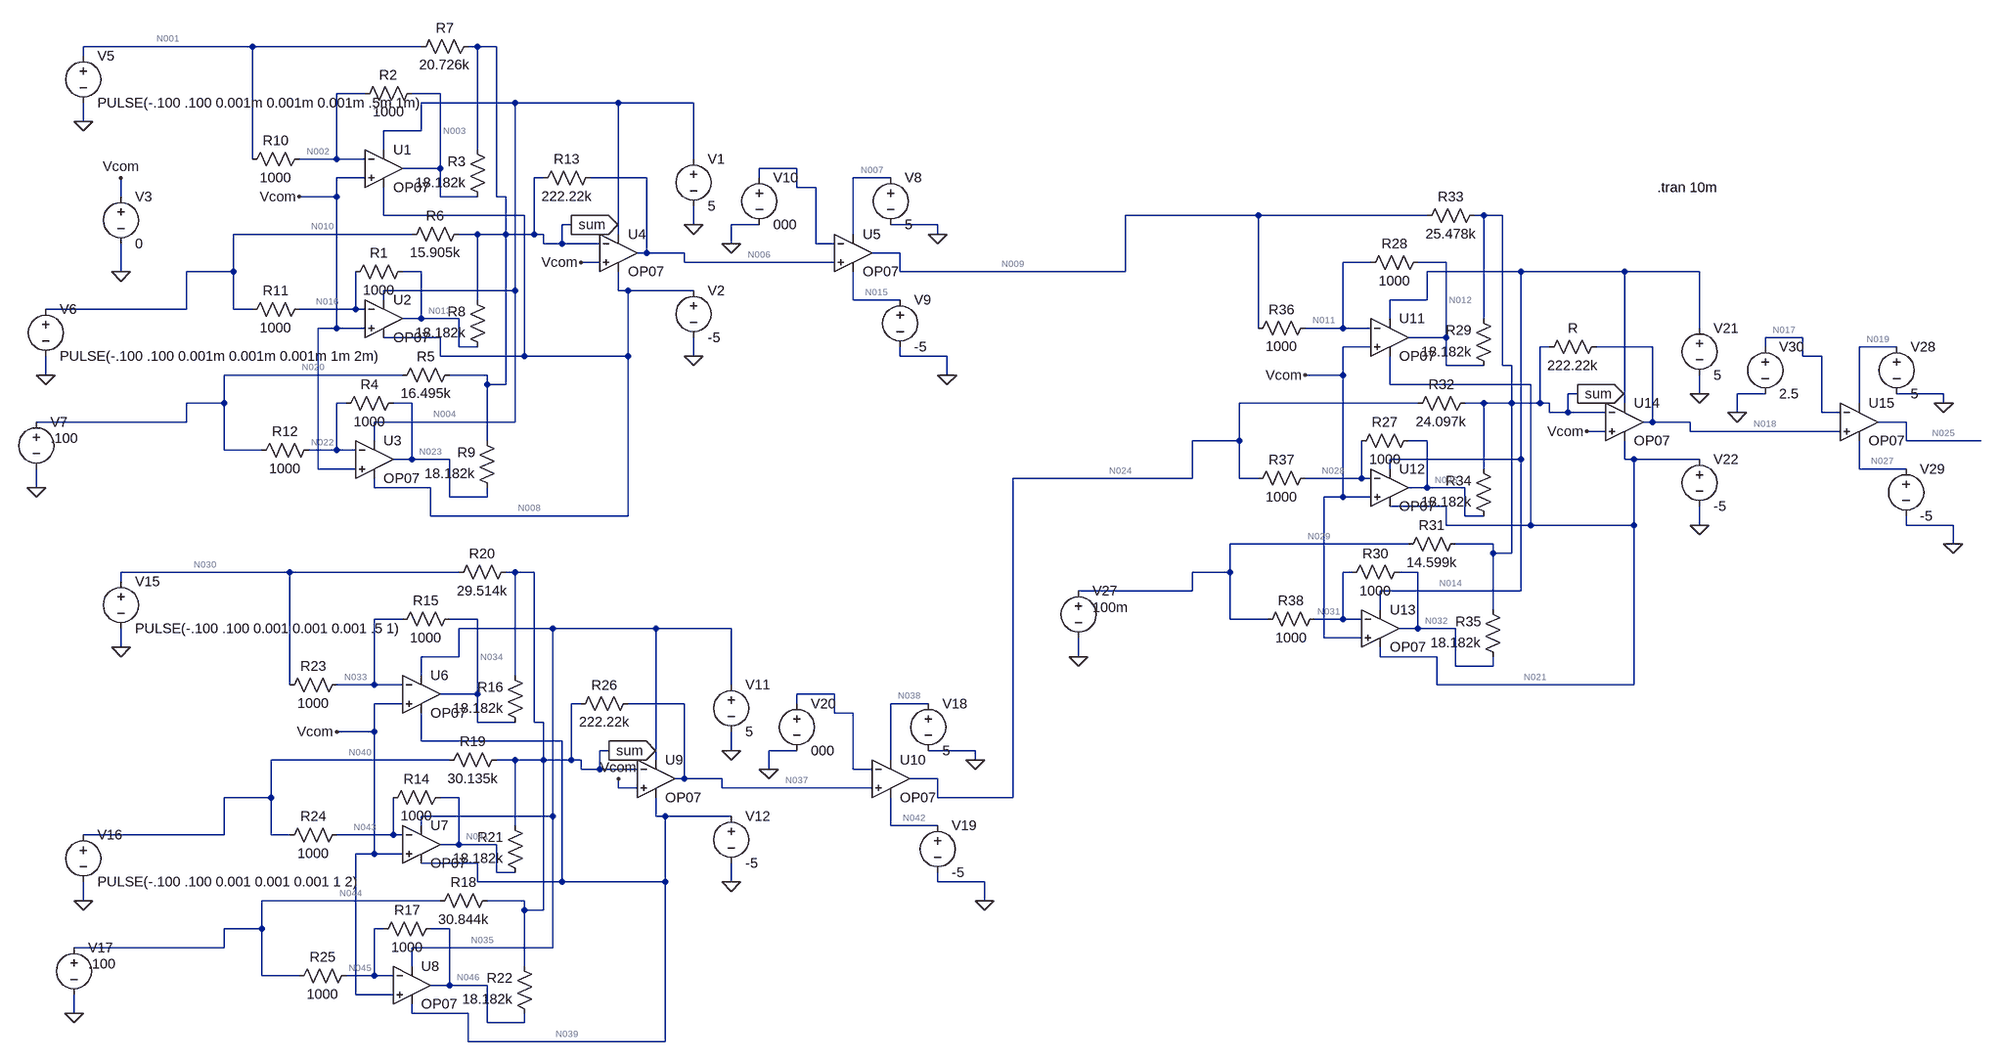
[diagram p0: schematic madaline.asc]
madaline.asc, the LTspice schematic file:
Version 4
SHEET 1 880 680
WIRE -2400 -2560 -2688 -2560
WIRE -2112 -2560 -2400 -2560
WIRE -2016 -2560 -2032 -2560
WIRE -1984 -2560 -2016 -2560
WIRE -2688 -2544 -2688 -2560
WIRE -2208 -2480 -2256 -2480
WIRE -2080 -2480 -2128 -2480
WIRE -1952 -2464 -2112 -2464
WIRE -1776 -2464 -1952 -2464
WIRE -1648 -2464 -1776 -2464
WIRE -2688 -2432 -2688 -2464
WIRE -2112 -2416 -2112 -2464
WIRE -2112 -2416 -2176 -2416
WIRE -2176 -2384 -2176 -2416
WIRE -2016 -2384 -2016 -2560
WIRE -2400 -2368 -2400 -2560
WIRE -2256 -2368 -2256 -2480
WIRE -2256 -2368 -2320 -2368
WIRE -2208 -2368 -2256 -2368
WIRE -1648 -2368 -1648 -2464
WIRE -2080 -2352 -2080 -2480
WIRE -2080 -2352 -2144 -2352
WIRE -1472 -2352 -1536 -2352
WIRE -2208 -2336 -2256 -2336
WIRE -1904 -2336 -1920 -2336
WIRE -1728 -2336 -1824 -2336
WIRE -1536 -2336 -1536 -2352
WIRE -1312 -2336 -1376 -2336
WIRE -1472 -2320 -1472 -2352
WIRE -1440 -2320 -1472 -2320
WIRE -2624 -2304 -2624 -2336
WIRE -2256 -2304 -2256 -2336
WIRE -2256 -2304 -2320 -2304
WIRE -2080 -2304 -2080 -2352
WIRE -2016 -2304 -2080 -2304
WIRE -1984 -2304 -1984 -2560
WIRE -1968 -2304 -1984 -2304
WIRE -2176 -2272 -2176 -2320
WIRE -1936 -2272 -2176 -2272
WIRE -624 -2272 -912 -2272
WIRE -336 -2272 -624 -2272
WIRE -240 -2272 -256 -2272
WIRE -208 -2272 -240 -2272
WIRE -1856 -2256 -1872 -2256
WIRE -1648 -2256 -1648 -2288
WIRE -1536 -2256 -1584 -2256
WIRE -1232 -2256 -1312 -2256
WIRE -2128 -2240 -2432 -2240
WIRE -2016 -2240 -2048 -2240
WIRE -1968 -2240 -1968 -2304
WIRE -1968 -2240 -2016 -2240
WIRE -1920 -2240 -1920 -2336
WIRE -1920 -2240 -1968 -2240
WIRE -1904 -2240 -1920 -2240
WIRE -1776 -2240 -1776 -2464
WIRE -1376 -2240 -1376 -2336
WIRE -1232 -2240 -1232 -2256
WIRE -1904 -2224 -1904 -2240
WIRE -1872 -2224 -1872 -2256
WIRE -1872 -2224 -1904 -2224
WIRE -1808 -2224 -1872 -2224
WIRE -1584 -2224 -1584 -2256
WIRE -1440 -2224 -1440 -2320
WIRE -1408 -2224 -1440 -2224
WIRE -1728 -2208 -1728 -2336
WIRE -1728 -2208 -1744 -2208
WIRE -1664 -2208 -1728 -2208
WIRE -1296 -2208 -1344 -2208
WIRE -1808 -2192 -1840 -2192
WIRE -1664 -2192 -1664 -2208
WIRE -1408 -2192 -1664 -2192
WIRE -432 -2192 -480 -2192
WIRE -304 -2192 -352 -2192
WIRE -2624 -2176 -2624 -2224
WIRE -2432 -2176 -2432 -2240
WIRE -2432 -2176 -2512 -2176
WIRE -2112 -2176 -2144 -2176
WIRE -1296 -2176 -1296 -2208
WIRE -912 -2176 -912 -2272
WIRE -912 -2176 -1296 -2176
WIRE -176 -2176 -336 -2176
WIRE 0 -2176 -176 -2176
WIRE 128 -2176 0 -2176
WIRE -1952 -2144 -1952 -2464
WIRE -1952 -2144 -2176 -2144
WIRE -1776 -2144 -1776 -2176
WIRE -1760 -2144 -1776 -2144
WIRE -1648 -2144 -1760 -2144
WIRE -2176 -2128 -2176 -2144
WIRE -2016 -2128 -2016 -2240
WIRE -1376 -2128 -1376 -2176
WIRE -1296 -2128 -1376 -2128
WIRE -336 -2128 -336 -2176
WIRE -336 -2128 -400 -2128
WIRE -2512 -2112 -2512 -2176
WIRE -2512 -2112 -2752 -2112
WIRE -2432 -2112 -2432 -2176
WIRE -2400 -2112 -2432 -2112
WIRE -2224 -2112 -2224 -2176
WIRE -2224 -2112 -2320 -2112
WIRE -2208 -2112 -2224 -2112
WIRE -2112 -2096 -2112 -2176
WIRE -2112 -2096 -2144 -2096
WIRE -2048 -2096 -2112 -2096
WIRE -400 -2096 -400 -2128
WIRE -240 -2096 -240 -2272
WIRE -2256 -2080 -2256 -2304
WIRE -2256 -2080 -2288 -2080
WIRE -2208 -2080 -2256 -2080
WIRE -624 -2080 -624 -2272
WIRE -480 -2080 -480 -2192
WIRE -480 -2080 -544 -2080
WIRE -432 -2080 -480 -2080
WIRE 128 -2080 128 -2176
WIRE -2080 -2064 -2176 -2064
WIRE -304 -2064 -304 -2192
WIRE -304 -2064 -368 -2064
WIRE 304 -2064 240 -2064
WIRE -2048 -2048 -2048 -2096
WIRE -2016 -2048 -2048 -2048
WIRE -432 -2048 -480 -2048
WIRE -128 -2048 -144 -2048
WIRE 48 -2048 -48 -2048
WIRE 240 -2048 240 -2064
WIRE 464 -2048 400 -2048
WIRE -2080 -2032 -2080 -2064
WIRE -1936 -2032 -1936 -2272
WIRE -1936 -2032 -2080 -2032
WIRE -1760 -2032 -1760 -2144
WIRE -1760 -2032 -1936 -2032
WIRE -1648 -2032 -1648 -2064
WIRE -1296 -2032 -1296 -2048
WIRE -1216 -2032 -1296 -2032
WIRE 304 -2032 304 -2064
WIRE 336 -2032 304 -2032
WIRE -304 -2016 -304 -2064
WIRE -240 -2016 -304 -2016
WIRE -208 -2016 -208 -2272
WIRE -192 -2016 -208 -2016
WIRE -2752 -2000 -2752 -2032
WIRE -2144 -2000 -2448 -2000
WIRE -2000 -2000 -2064 -2000
WIRE -1216 -2000 -1216 -2032
WIRE -480 -2000 -480 -2048
WIRE -480 -2000 -544 -2000
WIRE -2000 -1984 -2000 -2000
WIRE -1968 -1984 -1968 -2240
WIRE -1968 -1984 -2000 -1984
WIRE -400 -1984 -400 -2032
WIRE -160 -1984 -400 -1984
WIRE -80 -1968 -96 -1968
WIRE 128 -1968 128 -2000
WIRE 240 -1968 192 -1968
WIRE 544 -1968 464 -1968
WIRE -2448 -1952 -2448 -2000
WIRE -2448 -1952 -2512 -1952
WIRE -2240 -1952 -2256 -1952
WIRE -2128 -1952 -2160 -1952
WIRE -352 -1952 -656 -1952
WIRE -240 -1952 -272 -1952
WIRE -192 -1952 -192 -2016
WIRE -192 -1952 -240 -1952
WIRE -144 -1952 -144 -2048
WIRE -144 -1952 -192 -1952
WIRE -128 -1952 -144 -1952
WIRE 0 -1952 0 -2176
WIRE 400 -1952 400 -2048
WIRE 544 -1952 544 -1968
WIRE -128 -1936 -128 -1952
WIRE -96 -1936 -96 -1968
WIRE -96 -1936 -128 -1936
WIRE -32 -1936 -96 -1936
WIRE 192 -1936 192 -1968
WIRE 336 -1936 336 -2032
WIRE 368 -1936 336 -1936
WIRE -2512 -1920 -2512 -1952
WIRE -2512 -1920 -2768 -1920
WIRE -1952 -1920 -1952 -2144
WIRE -1952 -1920 -2192 -1920
WIRE 48 -1920 48 -2048
WIRE 48 -1920 32 -1920
WIRE 112 -1920 48 -1920
WIRE 480 -1920 432 -1920
WIRE -32 -1904 -64 -1904
WIRE 112 -1904 112 -1920
WIRE 368 -1904 112 -1904
WIRE -2192 -1888 -2192 -1920
WIRE -2000 -1888 -2000 -1984
WIRE -656 -1888 -656 -1952
WIRE -656 -1888 -736 -1888
WIRE -336 -1888 -368 -1888
WIRE 480 -1888 480 -1920
WIRE 608 -1888 480 -1888
WIRE -2448 -1872 -2448 -1952
WIRE -2384 -1872 -2448 -1872
WIRE -2256 -1872 -2256 -1952
WIRE -2256 -1872 -2304 -1872
WIRE -2224 -1872 -2256 -1872
WIRE -2128 -1856 -2128 -1952
WIRE -2128 -1856 -2160 -1856
WIRE -2064 -1856 -2128 -1856
WIRE -176 -1856 -176 -2176
WIRE -176 -1856 -400 -1856
WIRE 0 -1856 0 -1888
WIRE 16 -1856 0 -1856
WIRE 128 -1856 16 -1856
WIRE -2288 -1840 -2288 -2080
WIRE -2224 -1840 -2288 -1840
WIRE -400 -1840 -400 -1856
WIRE -240 -1840 -240 -1952
WIRE 400 -1840 400 -1888
WIRE 480 -1840 400 -1840
WIRE -736 -1824 -736 -1888
WIRE -736 -1824 -1104 -1824
WIRE -656 -1824 -656 -1888
WIRE -624 -1824 -656 -1824
WIRE -448 -1824 -448 -1888
WIRE -448 -1824 -544 -1824
WIRE -432 -1824 -448 -1824
WIRE -2768 -1808 -2768 -1840
WIRE -2192 -1808 -2192 -1824
WIRE -2096 -1808 -2192 -1808
WIRE -336 -1808 -336 -1888
WIRE -336 -1808 -368 -1808
WIRE -272 -1808 -336 -1808
WIRE -2064 -1792 -2064 -1856
WIRE -2000 -1792 -2000 -1808
WIRE -2000 -1792 -2064 -1792
WIRE -480 -1792 -480 -2000
WIRE -480 -1792 -512 -1792
WIRE -432 -1792 -480 -1792
WIRE -304 -1776 -400 -1776
WIRE -2096 -1760 -2096 -1808
WIRE -1760 -1760 -1760 -2032
WIRE -1760 -1760 -2096 -1760
WIRE -272 -1760 -272 -1808
WIRE -240 -1760 -272 -1760
WIRE -304 -1744 -304 -1776
WIRE -160 -1744 -160 -1984
WIRE -160 -1744 -304 -1744
WIRE 16 -1744 16 -1856
WIRE 16 -1744 -160 -1744
WIRE 128 -1744 128 -1776
WIRE 480 -1744 480 -1760
WIRE 560 -1744 480 -1744
WIRE -368 -1712 -672 -1712
WIRE -224 -1712 -288 -1712
WIRE 560 -1712 560 -1744
WIRE -224 -1696 -224 -1712
WIRE -192 -1696 -192 -1952
WIRE -192 -1696 -224 -1696
WIRE -2336 -1664 -2624 -1664
WIRE -2048 -1664 -2336 -1664
WIRE -1952 -1664 -1968 -1664
WIRE -1920 -1664 -1952 -1664
WIRE -672 -1664 -672 -1712
WIRE -672 -1664 -736 -1664
WIRE -464 -1664 -480 -1664
WIRE -352 -1664 -384 -1664
WIRE -2624 -1648 -2624 -1664
WIRE -736 -1632 -736 -1664
WIRE -736 -1632 -992 -1632
WIRE -176 -1632 -176 -1856
WIRE -176 -1632 -416 -1632
WIRE -416 -1600 -416 -1632
WIRE -224 -1600 -224 -1696
WIRE -2144 -1584 -2192 -1584
WIRE -2016 -1584 -2064 -1584
WIRE -672 -1584 -672 -1664
WIRE -608 -1584 -672 -1584
WIRE -480 -1584 -480 -1664
WIRE -480 -1584 -528 -1584
WIRE -448 -1584 -480 -1584
WIRE -1888 -1568 -2048 -1568
WIRE -1712 -1568 -1888 -1568
WIRE -1584 -1568 -1712 -1568
WIRE -352 -1568 -352 -1664
WIRE -352 -1568 -384 -1568
WIRE -288 -1568 -352 -1568
WIRE -512 -1552 -512 -1792
WIRE -448 -1552 -512 -1552
WIRE -2624 -1536 -2624 -1568
WIRE -2048 -1520 -2048 -1568
WIRE -2048 -1520 -2112 -1520
WIRE -992 -1520 -992 -1552
WIRE -416 -1520 -416 -1536
WIRE -320 -1520 -416 -1520
WIRE -288 -1504 -288 -1568
WIRE -224 -1504 -224 -1520
WIRE -224 -1504 -288 -1504
WIRE -2112 -1488 -2112 -1520
WIRE -1952 -1488 -1952 -1664
WIRE -2336 -1472 -2336 -1664
WIRE -2192 -1472 -2192 -1584
WIRE -2192 -1472 -2256 -1472
WIRE -2144 -1472 -2192 -1472
WIRE -1584 -1472 -1584 -1568
WIRE -320 -1472 -320 -1520
WIRE 16 -1472 16 -1744
WIRE 16 -1472 -320 -1472
WIRE -2016 -1456 -2016 -1584
WIRE -2016 -1456 -2080 -1456
WIRE -1408 -1456 -1472 -1456
WIRE -2144 -1440 -2192 -1440
WIRE -1840 -1440 -1856 -1440
WIRE -1664 -1440 -1760 -1440
WIRE -1472 -1440 -1472 -1456
WIRE -1248 -1440 -1312 -1440
WIRE -1408 -1424 -1408 -1456
WIRE -1376 -1424 -1408 -1424
WIRE -2016 -1408 -2016 -1456
WIRE -1952 -1408 -2016 -1408
WIRE -1920 -1408 -1920 -1664
WIRE -1904 -1408 -1920 -1408
WIRE -2192 -1392 -2192 -1440
WIRE -2192 -1392 -2256 -1392
WIRE -2112 -1376 -2112 -1424
WIRE -1872 -1376 -2112 -1376
WIRE -1792 -1360 -1808 -1360
WIRE -1584 -1360 -1584 -1392
WIRE -1472 -1360 -1520 -1360
WIRE -1168 -1360 -1248 -1360
WIRE -2064 -1344 -2368 -1344
WIRE -1952 -1344 -1984 -1344
WIRE -1904 -1344 -1904 -1408
WIRE -1904 -1344 -1952 -1344
WIRE -1856 -1344 -1856 -1440
WIRE -1856 -1344 -1904 -1344
WIRE -1840 -1344 -1856 -1344
WIRE -1712 -1344 -1712 -1568
WIRE -1312 -1344 -1312 -1440
WIRE -1168 -1344 -1168 -1360
WIRE -1840 -1328 -1840 -1344
WIRE -1808 -1328 -1808 -1360
WIRE -1808 -1328 -1840 -1328
WIRE -1744 -1328 -1808 -1328
WIRE -1520 -1328 -1520 -1360
WIRE -1376 -1328 -1376 -1424
WIRE -1344 -1328 -1376 -1328
WIRE -1664 -1312 -1664 -1440
WIRE -1664 -1312 -1680 -1312
WIRE -1600 -1312 -1664 -1312
WIRE -1232 -1312 -1280 -1312
WIRE -1776 -1296 -1776 -1312
WIRE -1744 -1296 -1776 -1296
WIRE -1600 -1296 -1600 -1312
WIRE -1344 -1296 -1600 -1296
WIRE -2368 -1280 -2368 -1344
WIRE -2368 -1280 -2448 -1280
WIRE -2048 -1280 -2080 -1280
WIRE -1232 -1280 -1232 -1312
WIRE -1104 -1280 -1104 -1824
WIRE -1104 -1280 -1232 -1280
WIRE -1888 -1248 -1888 -1568
WIRE -1888 -1248 -2112 -1248
WIRE -1712 -1248 -1712 -1280
WIRE -1696 -1248 -1712 -1248
WIRE -1584 -1248 -1696 -1248
WIRE -2112 -1232 -2112 -1248
WIRE -1952 -1232 -1952 -1344
WIRE -1312 -1232 -1312 -1280
WIRE -1232 -1232 -1312 -1232
WIRE -2448 -1216 -2448 -1280
WIRE -2448 -1216 -2688 -1216
WIRE -2368 -1216 -2368 -1280
WIRE -2336 -1216 -2368 -1216
WIRE -2160 -1216 -2160 -1280
WIRE -2160 -1216 -2256 -1216
WIRE -2144 -1216 -2160 -1216
WIRE -2048 -1200 -2048 -1280
WIRE -2048 -1200 -2080 -1200
WIRE -1984 -1200 -2048 -1200
WIRE -2192 -1184 -2192 -1392
WIRE -2192 -1184 -2224 -1184
WIRE -2144 -1184 -2192 -1184
WIRE -2016 -1168 -2112 -1168
WIRE -1984 -1152 -1984 -1200
WIRE -1952 -1152 -1984 -1152
WIRE -2016 -1136 -2016 -1168
WIRE -1872 -1136 -1872 -1376
WIRE -1872 -1136 -2016 -1136
WIRE -1696 -1136 -1696 -1248
WIRE -1696 -1136 -1872 -1136
WIRE -1584 -1136 -1584 -1168
WIRE -1232 -1136 -1232 -1152
WIRE -1152 -1136 -1232 -1136
WIRE -2688 -1104 -2688 -1136
WIRE -2080 -1104 -2384 -1104
WIRE -1936 -1104 -2000 -1104
WIRE -1152 -1104 -1152 -1136
WIRE -1936 -1088 -1936 -1104
WIRE -1904 -1088 -1904 -1344
WIRE -1904 -1088 -1936 -1088
WIRE -2384 -1056 -2384 -1104
WIRE -2384 -1056 -2448 -1056
WIRE -2176 -1056 -2192 -1056
WIRE -2064 -1056 -2096 -1056
WIRE -2448 -1024 -2448 -1056
WIRE -2448 -1024 -2704 -1024
WIRE -1888 -1024 -1888 -1248
WIRE -1888 -1024 -2128 -1024
WIRE -2128 -992 -2128 -1024
WIRE -1936 -992 -1936 -1088
WIRE -2384 -976 -2384 -1056
WIRE -2320 -976 -2384 -976
WIRE -2192 -976 -2192 -1056
WIRE -2192 -976 -2240 -976
WIRE -2160 -976 -2192 -976
WIRE -2064 -960 -2064 -1056
WIRE -2064 -960 -2096 -960
WIRE -2000 -960 -2064 -960
WIRE -2224 -944 -2224 -1184
WIRE -2160 -944 -2224 -944
WIRE -2704 -912 -2704 -944
WIRE -2128 -912 -2128 -928
WIRE -2032 -912 -2128 -912
WIRE -2000 -896 -2000 -960
WIRE -1936 -896 -1936 -912
WIRE -1936 -896 -2000 -896
WIRE -2032 -864 -2032 -912
WIRE -1696 -864 -1696 -1136
WIRE -1696 -864 -2032 -864
FLAG -1648 -2256 0
FLAG -1648 -2032 0
FLAG -2624 -2176 0
FLAG -2688 -2432 0
FLAG -2752 -2000 0
FLAG -2768 -1808 0
FLAG -1232 -2240 0
FLAG -1216 -2000 0
FLAG -1584 -2224 0
FLAG -1856 -2256 sum
IOPIN -1856 -2256 Out
FLAG -1584 -1360 0
FLAG -1584 -1136 0
FLAG -2624 -1536 0
FLAG -2688 -1104 0
FLAG -2704 -912 0
FLAG -1168 -1344 0
FLAG -1152 -1104 0
FLAG -1520 -1328 0
FLAG -1792 -1360 sum
IOPIN -1792 -1360 Out
FLAG 128 -1968 0
FLAG 128 -1744 0
FLAG -992 -1520 0
FLAG 544 -1952 0
FLAG 560 -1712 0
FLAG 192 -1936 0
FLAG -80 -1968 sum
IOPIN -80 -1968 Out
FLAG -2624 -2336 Vcom
FLAG -2320 -2304 Vcom
FLAG -2256 -1392 Vcom
FLAG -544 -2000 Vcom
FLAG -1840 -2192 Vcom
FLAG -1776 -1312 Vcom
FLAG -64 -1904 Vcom
SYMBOL Opamps\\OP07 -2176 -2416 R0
SYMATTR InstName U1
SYMBOL Opamps\\OP07 -2176 -2160 R0
SYMATTR InstName U2
SYMBOL Opamps\\OP07 -2192 -1920 R0
SYMATTR InstName U3
SYMBOL Opamps\\OP07 -1776 -2272 R0
SYMATTR InstName U4
SYMBOL voltage -1648 -2384 R0
WINDOW 123 0 0 Left 2
WINDOW 39 0 0 Left 2
SYMATTR InstName V1
SYMATTR Value 5
SYMBOL voltage -1648 -2160 R0
WINDOW 123 0 0 Left 2
WINDOW 39 0 0 Left 2
SYMATTR InstName V2
SYMATTR Value -5
SYMBOL res -2128 -2192 R90
WINDOW 0 0 56 VBottom 2
WINDOW 3 32 56 VTop 2
SYMATTR InstName R1
SYMATTR Value 1000
SYMBOL res -2112 -2496 R90
WINDOW 0 0 56 VBottom 2
WINDOW 3 32 56 VTop 2
SYMATTR InstName R2
SYMATTR Value 1000
SYMBOL res -2000 -2288 R180
WINDOW 0 36 76 Left 2
WINDOW 3 36 40 Left 2
SYMATTR InstName R3
SYMATTR Value 18.182k
SYMBOL res -2144 -1968 R90
WINDOW 0 0 56 VBottom 2
WINDOW 3 32 56 VTop 2
SYMATTR InstName R4
SYMATTR Value 1000
SYMBOL res -2048 -2016 R90
WINDOW 0 0 56 VBottom 2
WINDOW 3 32 56 VTop 2
SYMATTR InstName R5
SYMATTR Value 16.495k
SYMBOL res -2032 -2256 R90
WINDOW 0 0 56 VBottom 2
WINDOW 3 32 56 VTop 2
SYMATTR InstName R6
SYMATTR Value 15.905k
SYMBOL res -2016 -2576 R90
WINDOW 0 0 56 VBottom 2
WINDOW 3 32 56 VTop 2
SYMATTR InstName R7
SYMATTR Value 20.726k
SYMBOL res -2000 -2032 R180
WINDOW 0 36 76 Left 2
WINDOW 3 36 40 Left 2
SYMATTR InstName R8
SYMATTR Value 18.182k
SYMBOL res -1984 -1792 R180
WINDOW 0 36 76 Left 2
WINDOW 3 36 40 Left 2
SYMATTR InstName R9
SYMATTR Value 18.182k
SYMBOL res -2304 -2384 R90
WINDOW 0 0 56 VBottom 2
WINDOW 3 32 56 VTop 2
SYMATTR InstName R10
SYMATTR Value 1000
SYMBOL res -2304 -2128 R90
WINDOW 0 0 56 VBottom 2
WINDOW 3 32 56 VTop 2
SYMATTR InstName R11
SYMATTR Value 1000
SYMBOL res -2288 -1888 R90
WINDOW 0 0 56 VBottom 2
WINDOW 3 32 56 VTop 2
SYMATTR InstName R12
SYMATTR Value 1000
SYMBOL res -1808 -2352 R90
WINDOW 0 0 56 VBottom 2
WINDOW 3 32 56 VTop 2
SYMATTR InstName R13
SYMATTR Value 222.22k
SYMBOL voltage -2624 -2320 R0
WINDOW 123 0 0 Left 2
WINDOW 39 0 0 Left 2
SYMATTR InstName V3
SYMATTR Value 0
SYMBOL voltage -2688 -2560 R0
WINDOW 123 0 0 Left 2
WINDOW 39 0 0 Left 2
SYMATTR InstName V5
SYMATTR Value PULSE(-.100 .100 0.001m 0.001m 0.001m .5m 1m)
SYMBOL voltage -2752 -2128 R0
WINDOW 123 0 0 Left 2
WINDOW 39 0 0 Left 2
SYMATTR InstName V6
SYMATTR Value PULSE(-.100 .100 0.001m 0.001m 0.001m 1m 2m)
SYMBOL voltage -2768 -1936 R0
WINDOW 3 24 44 Left 2
WINDOW 123 0 0 Left 2
WINDOW 39 0 0 Left 2
SYMATTR Value .100
SYMATTR InstName V7
SYMBOL Opamps\\OP07 -1376 -2272 R0
SYMATTR InstName U5
SYMBOL voltage -1312 -2352 R0
WINDOW 123 0 0 Left 2
WINDOW 39 0 0 Left 2
SYMATTR InstName V8
SYMATTR Value 5
SYMBOL voltage -1296 -2144 R0
WINDOW 123 0 0 Left 2
WINDOW 39 0 0 Left 2
SYMATTR InstName V9
SYMATTR Value -5
SYMBOL voltage -1536 -2352 R0
WINDOW 123 0 0 Left 2
WINDOW 39 0 0 Left 2
SYMATTR InstName V10
SYMATTR Value 000
SYMBOL Opamps\\OP07 -2112 -1520 R0
SYMATTR InstName U6
SYMBOL Opamps\\OP07 -2112 -1264 R0
SYMATTR InstName U7
SYMBOL Opamps\\OP07 -2128 -1024 R0
SYMATTR InstName U8
SYMBOL Opamps\\OP07 -1712 -1376 R0
SYMATTR InstName U9
SYMBOL voltage -1584 -1488 R0
WINDOW 123 0 0 Left 2
WINDOW 39 0 0 Left 2
SYMATTR InstName V11
SYMATTR Value 5
SYMBOL voltage -1584 -1264 R0
WINDOW 123 0 0 Left 2
WINDOW 39 0 0 Left 2
SYMATTR InstName V12
SYMATTR Value -5
SYMBOL res -2064 -1296 R90
WINDOW 0 0 56 VBottom 2
WINDOW 3 32 56 VTop 2
SYMATTR InstName R14
SYMATTR Value 1000
SYMBOL res -2048 -1600 R90
WINDOW 0 0 56 VBottom 2
WINDOW 3 32 56 VTop 2
SYMATTR InstName R15
SYMATTR Value 1000
SYMBOL res -1936 -1392 R180
WINDOW 0 36 76 Left 2
WINDOW 3 36 40 Left 2
SYMATTR InstName R16
SYMATTR Value 18.182k
SYMBOL res -2080 -1072 R90
WINDOW 0 0 56 VBottom 2
WINDOW 3 32 56 VTop 2
SYMATTR InstName R17
SYMATTR Value 1000
SYMBOL res -1984 -1120 R90
WINDOW 0 0 56 VBottom 2
WINDOW 3 32 56 VTop 2
SYMATTR InstName R18
SYMATTR Value 30.844k
SYMBOL res -1968 -1360 R90
WINDOW 0 0 56 VBottom 2
WINDOW 3 32 56 VTop 2
SYMATTR InstName R19
SYMATTR Value 30.135k
SYMBOL res -1952 -1680 R90
WINDOW 0 0 56 VBottom 2
WINDOW 3 32 56 VTop 2
SYMATTR InstName R20
SYMATTR Value 29.514k
SYMBOL res -1936 -1136 R180
WINDOW 0 36 76 Left 2
WINDOW 3 36 40 Left 2
SYMATTR InstName R21
SYMATTR Value 18.182k
SYMBOL res -1920 -896 R180
WINDOW 0 36 76 Left 2
WINDOW 3 36 40 Left 2
SYMATTR InstName R22
SYMATTR Value 18.182k
SYMBOL res -2240 -1488 R90
WINDOW 0 0 56 VBottom 2
WINDOW 3 32 56 VTop 2
SYMATTR InstName R23
SYMATTR Value 1000
SYMBOL res -2240 -1232 R90
WINDOW 0 0 56 VBottom 2
WINDOW 3 32 56 VTop 2
SYMATTR InstName R24
SYMATTR Value 1000
SYMBOL res -2224 -992 R90
WINDOW 0 0 56 VBottom 2
WINDOW 3 32 56 VTop 2
SYMATTR InstName R25
SYMATTR Value 1000
SYMBOL res -1744 -1456 R90
WINDOW 0 0 56 VBottom 2
WINDOW 3 32 56 VTop 2
SYMATTR InstName R26
SYMATTR Value 222.22k
SYMBOL voltage -2624 -1664 R0
WINDOW 123 0 0 Left 2
WINDOW 39 0 0 Left 2
SYMATTR InstName V15
SYMATTR Value PULSE(-.100 .100 0.001 0.001 0.001 .5 1)
SYMBOL voltage -2688 -1232 R0
WINDOW 123 0 0 Left 2
WINDOW 39 0 0 Left 2
SYMATTR InstName V16
SYMATTR Value PULSE(-.100 .100 0.001 0.001 0.001 1 2)
SYMBOL voltage -2704 -1040 R0
WINDOW 3 24 44 Left 2
WINDOW 123 0 0 Left 2
WINDOW 39 0 0 Left 2
SYMATTR Value .100
SYMATTR InstName V17
SYMBOL Opamps\\OP07 -1312 -1376 R0
SYMATTR InstName U10
SYMBOL voltage -1248 -1456 R0
WINDOW 123 0 0 Left 2
WINDOW 39 0 0 Left 2
SYMATTR InstName V18
SYMATTR Value 5
SYMBOL voltage -1232 -1248 R0
WINDOW 123 0 0 Left 2
WINDOW 39 0 0 Left 2
SYMATTR InstName V19
SYMATTR Value -5
SYMBOL voltage -1472 -1456 R0
WINDOW 123 0 0 Left 2
WINDOW 39 0 0 Left 2
SYMATTR InstName V20
SYMATTR Value 000
SYMBOL Opamps\\OP07 -400 -2128 R0
SYMATTR InstName U11
SYMBOL Opamps\\OP07 -400 -1872 R0
SYMATTR InstName U12
SYMBOL Opamps\\OP07 -416 -1632 R0
SYMATTR InstName U13
SYMBOL Opamps\\OP07 0 -1984 R0
SYMATTR InstName U14
SYMBOL voltage 128 -2096 R0
WINDOW 123 0 0 Left 2
WINDOW 39 0 0 Left 2
SYMATTR InstName V21
SYMATTR Value 5
SYMBOL voltage 128 -1872 R0
WINDOW 123 0 0 Left 2
WINDOW 39 0 0 Left 2
SYMATTR InstName V22
SYMATTR Value -5
SYMBOL res -352 -1904 R90
WINDOW 0 0 56 VBottom 2
WINDOW 3 32 56 VTop 2
SYMATTR InstName R27
SYMATTR Value 1000
SYMBOL res -336 -2208 R90
WINDOW 0 0 56 VBottom 2
WINDOW 3 32 56 VTop 2
SYMATTR InstName R28
SYMATTR Value 1000
SYMBOL res -224 -2000 R180
WINDOW 0 36 76 Left 2
WINDOW 3 36 40 Left 2
SYMATTR InstName R29
SYMATTR Value 18.182k
SYMBOL res -368 -1680 R90
WINDOW 0 0 56 VBottom 2
WINDOW 3 32 56 VTop 2
SYMATTR InstName R30
SYMATTR Value 1000
SYMBOL res -272 -1728 R90
WINDOW 0 0 56 VBottom 2
WINDOW 3 32 56 VTop 2
SYMATTR InstName R31
SYMATTR Value 14.599k
SYMBOL res -256 -1968 R90
WINDOW 0 0 56 VBottom 2
WINDOW 3 32 56 VTop 2
SYMATTR InstName R32
SYMATTR Value 24.097k
SYMBOL res -240 -2288 R90
WINDOW 0 0 56 VBottom 2
WINDOW 3 32 56 VTop 2
SYMATTR InstName R33
SYMATTR Value 25.478k
SYMBOL res -224 -1744 R180
WINDOW 0 36 76 Left 2
WINDOW 3 36 40 Left 2
SYMATTR InstName R34
SYMATTR Value 18.182k
SYMBOL res -208 -1504 R180
WINDOW 0 36 76 Left 2
WINDOW 3 36 40 Left 2
SYMATTR InstName R35
SYMATTR Value 18.182k
SYMBOL res -528 -2096 R90
WINDOW 0 0 56 VBottom 2
WINDOW 3 32 56 VTop 2
SYMATTR InstName R36
SYMATTR Value 1000
SYMBOL res -528 -1840 R90
WINDOW 0 0 56 VBottom 2
WINDOW 3 32 56 VTop 2
SYMATTR InstName R37
SYMATTR Value 1000
SYMBOL res -512 -1600 R90
WINDOW 0 0 56 VBottom 2
WINDOW 3 32 56 VTop 2
SYMATTR InstName R38
SYMATTR Value 1000
SYMBOL res -32 -2064 R90
WINDOW 0 0 56 VBottom 2
WINDOW 3 32 56 VTop 2
SYMATTR InstName R
SYMATTR Value 222.22k
SYMBOL voltage -992 -1648 R0
WINDOW 3 24 44 Left 2
WINDOW 123 0 0 Left 2
WINDOW 39 0 0 Left 2
SYMATTR Value 100m
SYMATTR InstName V27
SYMBOL Opamps\\OP07 400 -1984 R0
SYMATTR InstName U15
SYMBOL voltage 464 -2064 R0
WINDOW 123 0 0 Left 2
WINDOW 39 0 0 Left 2
SYMATTR InstName V28
SYMATTR Value 5
SYMBOL voltage 480 -1856 R0
WINDOW 123 0 0 Left 2
WINDOW 39 0 0 Left 2
SYMATTR InstName V29
SYMATTR Value -5
SYMBOL voltage 240 -2064 R0
WINDOW 123 0 0 Left 2
WINDOW 39 0 0 Left 2
SYMATTR InstName V30
SYMATTR Value 2.5
TEXT 56 -2320 Left 2 !.tran 10m

The netlist it stands for:
* madaline.asc
XU1 Vcom N002 N004 N008 N003 LT1001  ; OP07, pins In+ In- V+ V- OUT
XU2 Vcom N016 N004 N008 N013 LT1001  ; OP07, pins In+ In- V+ V- OUT
XU3 Vcom N022 N004 N008 N023 LT1001  ; OP07, pins In+ In- V+ V- OUT
XU4 Vcom sum N004 N008 N006 LT1001  ; OP07, pins In+ In- V+ V- OUT
V1 N004 0 5
V2 N008 0 -5
R1 N013 N016 1000
R2 N003 N002 1000
R3 N003 sum 18.182k
R4 N023 N022 1000
R5 sum N020 16.495k
R6 sum N010 15.905k
R7 sum N001 20.726k
R8 N013 sum 18.182k
R9 N023 sum 18.182k
R10 N002 N001 1000
R11 N016 N010 1000
R12 N022 N020 1000
R13 N006 sum 222.22k
V3 Vcom 0 0
V5 N001 0 PULSE(-.100 .100 0.001m 0.001m 0.001m .5m 1m)
V6 N010 0 PULSE(-.100 .100 0.001m 0.001m 0.001m 1m 2m)
V7 N020 0 .100
XU5 N006 N005 N007 N015 N009 LT1001  ; OP07, pins In+ In- V+ V- OUT
V8 N007 0 5
V9 N015 0 -5
V10 N005 0 000
XU6 Vcom N033 N035 N039 N034 LT1001  ; OP07, pins In+ In- V+ V- OUT
XU7 Vcom N043 N035 N039 N041 LT1001  ; OP07, pins In+ In- V+ V- OUT
XU8 Vcom N045 N035 N039 N046 LT1001  ; OP07, pins In+ In- V+ V- OUT
XU9 Vcom sum N035 N039 N037 LT1001  ; OP07, pins In+ In- V+ V- OUT
V11 N035 0 5
V12 N039 0 -5
R14 N041 N043 1000
R15 N034 N033 1000
R16 N034 sum 18.182k
R17 N046 N045 1000
R18 sum N044 30.844k
R19 sum N040 30.135k
R20 sum N030 29.514k
R21 N041 sum 18.182k
R22 N046 sum 18.182k
R23 N033 N030 1000
R24 N043 N040 1000
R25 N045 N044 1000
R26 N037 sum 222.22k
V15 N030 0 PULSE(-.100 .100 0.001 0.001 0.001 .5 1)
V16 N040 0 PULSE(-.100 .100 0.001 0.001 0.001 1 2)
V17 N044 0 .100
XU10 N037 N036 N038 N042 N024 LT1001  ; OP07, pins In+ In- V+ V- OUT
V18 N038 0 5
V19 N042 0 -5
V20 N036 0 000
XU11 Vcom N011 N014 N021 N012 LT1001  ; OP07, pins In+ In- V+ V- OUT
XU12 Vcom N028 N014 N021 N026 LT1001  ; OP07, pins In+ In- V+ V- OUT
XU13 Vcom N031 N014 N021 N032 LT1001  ; OP07, pins In+ In- V+ V- OUT
XU14 Vcom sum N014 N021 N018 LT1001  ; OP07, pins In+ In- V+ V- OUT
V21 N014 0 5
V22 N021 0 -5
R27 N026 N028 1000
R28 N012 N011 1000
R29 N012 sum 18.182k
R30 N032 N031 1000
R31 sum N029 14.599k
R32 sum N024 24.097k
R33 sum N009 25.478k
R34 N026 sum 18.182k
R35 N032 sum 18.182k
R36 N011 N009 1000
R37 N028 N024 1000
R38 N031 N029 1000
R N018 sum 222.22k
V27 N029 0 100m
XU15 N018 N017 N019 N027 N025 LT1001  ; OP07, pins In+ In- V+ V- OUT
V28 N019 0 5
V29 N027 0 -5
V30 N017 0 2.5
.tran 10m
.lib LTC.lib
.backanno
.end

* Results of the author's LTspice run, read from the files saved beside the schematic
* Operating Point, zero values left out:
*   V(n002) = -138.6 nV
*   V(n004) = 5 V
*   V(n008) = -5 V
*   V(n003) = 100 mV
*   V(n016) = -138.6 nV
*   V(n013) = 100 mV
*   V(n022) = 138.9 nV
*   V(n023) = -100 mV
*   V(sum) = 68.87 mV
*   V(n006) = -3.992 V
*   V(n020) = 100 mV
*   V(n010) = -100 mV
*   V(n001) = -100 mV
*   V(n007) = 5 V
*   V(n015) = -5 V
*   V(n009) = -3.924 V
*   V(n033) = -138.6 nV
*   V(n035) = 5 V
*   V(n039) = -5 V
*   V(n034) = 100 mV
*   V(n043) = -138.6 nV
*   V(n041) = 100 mV
*   V(n045) = 138.9 nV
*   V(n046) = -100 mV
*   V(n037) = -3.992 V
*   V(n044) = 100 mV
*   V(n040) = -100 mV
*   V(n030) = -100 mV
*   V(n038) = 5 V
*   V(n042) = -5 V
*   V(n024) = -3.924 V
*   V(n011) = -5.012 mV
*   V(n014) = 5 V
*   V(n021) = -5 V
*   V(n012) = 3.914 V
*   V(n028) = -4.878 mV
*   V(n026) = 3.914 V
*   V(n031) = 138.9 nV
*   V(n032) = -100 mV
*   V(n018) = -3.916 V
*   V(n029) = 100 mV
*   V(n017) = 2.5 V
*   V(n019) = 5 V
*   V(n027) = -5 V
*   V(n025) = -4.07 V
*   I(R) = -17.93 µA
*   I(R38) = -100 µA
*   I(R37) = 3.919 mA
*   I(R36) = 3.919 mA
*   I(R35) = -9.288 µA
*   I(R34) = 211.5 µA
*   I(R33) = 156.7 µA
*   I(R32) = 165.7 µA
*   I(R31) = -2.132 µA
*   I(R30) = -100 µA
*   I(R29) = 211.5 µA
*   I(R28) = 3.919 mA
*   I(R27) = 3.919 mA
*   I(R26) = -18.27 µA
*   I(R25) = -100 µA
*   I(R24) = 100 µA
*   I(R23) = 100 µA
*   I(R22) = -9.288 µA
*   I(R21) = 1.712 µA
*   I(R20) = 5.722 µA
*   I(R19) = 5.604 µA
*   I(R18) = -1.009 µA
*   I(R17) = -100 µA
*   I(R16) = 1.712 µA
*   I(R15) = 100 µA
*   I(R14) = 100 µA
*   I(R13) = -18.27 µA
*   I(R12) = -100 µA
*   I(R11) = 100 µA
*   I(R10) = 100 µA
*   I(R9) = -9.288 µA
*   I(R8) = 1.712 µA
*   I(R7) = 8.148 µA
*   I(R6) = 10.62 µA
*   I(R5) = -1.887 µA
*   I(R4) = -100 µA
*   I(R3) = 1.712 µA
*   I(R2) = 100 µA
*   I(R1) = 100 µA
*   I(V30) = -4.275 mA
*   I(V29) = 2.247 mA
*   I(V28) = -2.254 mA
*   I(V27) = -102.1 µA
*   I(V22) = 8.526 mA
*   I(V21) = -12.39 mA
*   I(V20) = -2.167 mA
*   I(V19) = 4.751 mA
*   I(V18) = -672.9 µA
*   I(V17) = -101 µA
*   I(V16) = 105.6 µA
*   I(V15) = 105.7 µA
*   I(V12) = 10.18 mA
*   I(V11) = -8.09 mA
*   I(V10) = -2.167 mA
*   I(V9) = 4.745 mA
*   I(V8) = -675.4 µA
*   I(V7) = -101.9 µA
*   I(V6) = 110.6 µA
*   I(V5) = 108.1 µA
*   I(V3) = 2.656 nA
*   I(V2) = 10.18 mA
*   I(V1) = -8.09 mA
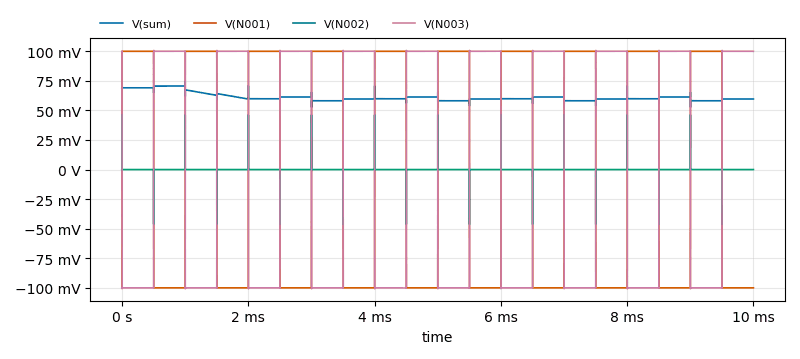
[diagram p1: Transient Analysis of madaline.asc, plotted from the saved traces]
* Transient Analysis, 1 run:
*   V(sum): min 52.7 mV, max 80.06 mV, average 61.14 mV, rms 61.23 mV, last 59.63 mV
*   V(N001): min -100 mV, max 100 mV, average 200 µV, rms 99.93 mV, last -100 mV
*   V(N002): min -46.27 mV, max 46.28 mV, average -802.8 nV, rms 1.766 mV, last -147.9 nV
*   V(N003): min -100.8 mV, max 100.8 mV, average -201.6 µV, rms 99.91 mV, last 100 mV